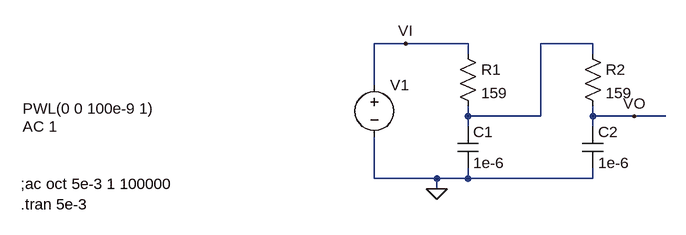
[diagram p0: schematic rc2_pwm.asc]
rc2_pwm.asc, the LTspice schematic file:
Version 4
SHEET 1 880 680
WIRE 96 0 48 0
WIRE 192 0 96 0
WIRE 384 0 304 0
WIRE 192 16 192 0
WIRE 384 16 384 0
WIRE 48 64 48 0
WIRE 192 112 192 96
WIRE 304 112 304 0
WIRE 304 112 192 112
WIRE 384 112 384 96
WIRE 448 112 384 112
WIRE 496 112 448 112
WIRE 192 128 192 112
WIRE 384 128 384 112
WIRE 48 208 48 144
WIRE 144 208 48 208
WIRE 192 208 192 192
WIRE 192 208 144 208
WIRE 384 208 384 192
WIRE 384 208 192 208
WIRE 144 224 144 208
FLAG 144 224 0
FLAG 96 0 VI
FLAG 448 112 VO
SYMBOL cap 176 128 R0
SYMATTR InstName C1
SYMATTR Value 1e-6
SYMBOL res 176 0 R0
SYMATTR InstName R1
SYMATTR Value 159
SYMBOL voltage 48 48 R0
WINDOW 3 -541 52 Left 2
WINDOW 123 -541 80 Left 2
WINDOW 39 0 0 Left 0
SYMATTR Value PWL(0 0 100e-9 1)
SYMATTR Value2 AC 1
SYMATTR InstName V1
SYMBOL cap 368 128 R0
SYMATTR InstName C2
SYMATTR Value 1e-6
SYMBOL res 368 0 R0
SYMATTR InstName R2
SYMATTR Value 159
TEXT -496 248 Left 2 !.tran 5e-3
TEXT -496 216 Left 2 !;ac oct 5e-3 1 100000

The netlist it stands for:
* rc2_pwm.asc
C1 N001 0 1e-6
R1 VI N001 159
V1 VI 0 PWL(0 0 100e-9 1) AC 1
C2 VO 0 1e-6
R2 N001 VO 159
.tran 5e-3
;ac oct 5e-3 1 100000
.backanno
.end

* Results of the author's LTspice run, read from the files saved beside the schematic
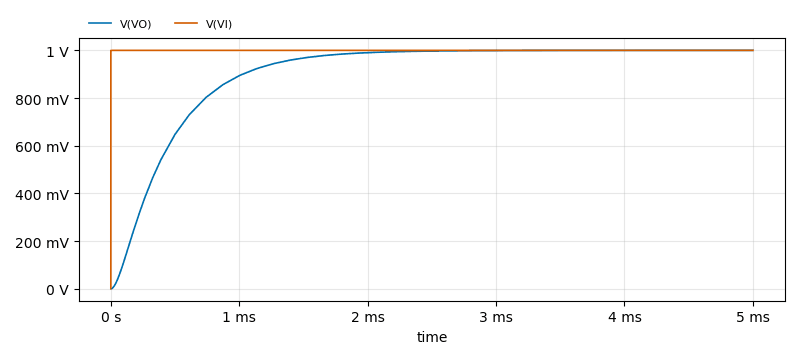
[diagram p1: Transient Analysis of rc2_pwm.asc, plotted from the saved traces]
* Transient Analysis, 1 run:
*   V(VO): min 0 V, max 1 V, average 904.3 mV, rms 928.4 mV, last 1 V
*   V(VI): min 0 V, max 1 V, average 1 V, rms 1 V, last 1 V